# Altium schematic sheet MCU.SchDoc
size A4
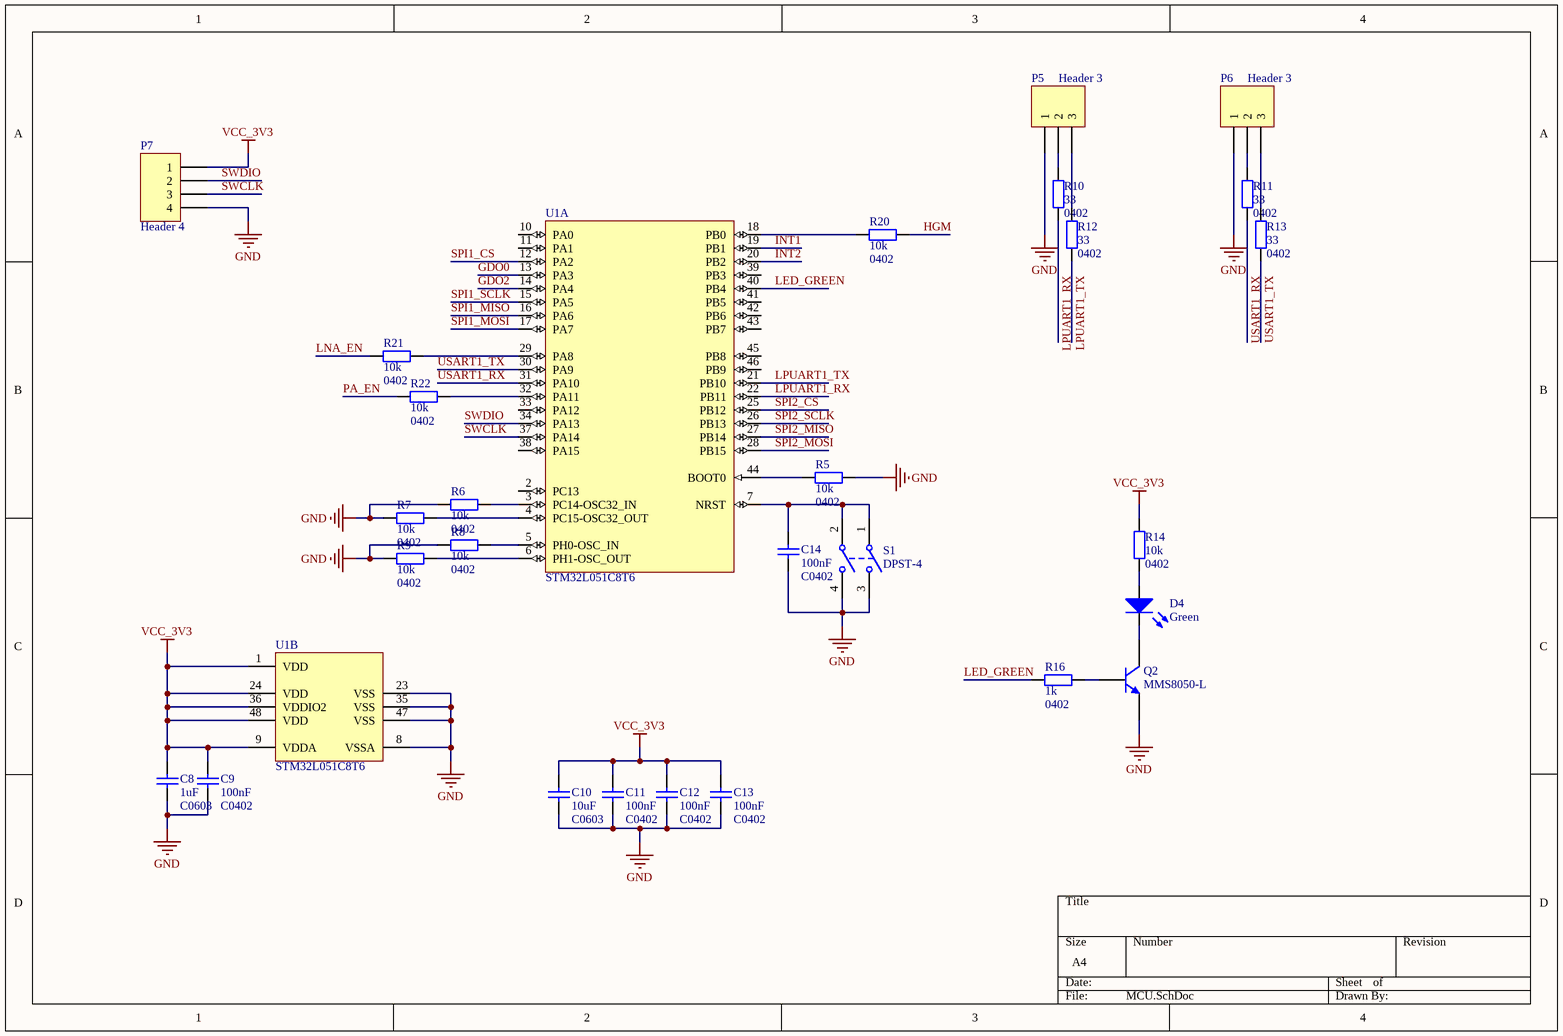
[diagram p0: MCU.SchDoc]

## Parts
C8  1uF  PackageReference: C0603  [1608[0603]]
C9  100nF  PackageReference: C0402  [0402]
C10  10uF  PackageReference: C0603  [1608[0603]]
C11  100nF  PackageReference: C0402  [0402]
C12  100nF  PackageReference: C0402  [0402]
C13  100nF  PackageReference: C0402  [0402]
C14  100nF  PackageReference: C0402  [0402]
D4  Green  [0603/K]
P5  Header 3  [HDR1X3]
P6  Header 3  [HDR1X3]
P7  Header 4  [HDR1x4-2MM]
Q2  MMS8050-L  [SOT-23B_N]
R5  10k  PackageReference: 0402  [RESC1005X04N]
R6  10k  PackageReference: 0402  [RESC1005X04N]
R7  10k  PackageReference: 0402  [RESC1005X04N]
R8  10k  PackageReference: 0402  [RESC1005X04N]
R9  10k  PackageReference: 0402  [RESC1005X04N]
R10  33  PackageReference: 0402  [RESC1005X04N]
R11  33  PackageReference: 0402  [RESC1005X04N]
R12  33  PackageReference: 0402  [RESC1005X04N]
R13  33  PackageReference: 0402  [RESC1005X04N]
R14  10k  PackageReference: 0402  [RESC1005X04N]
R16  1k  PackageReference: 0402  [RESC1005X04N]
R20  10k  PackageReference: 0402  [RESC1005X04N]
R21  10k  PackageReference: 0402  [RESC1005X04N]
R22  10k  PackageReference: 0402  [RESC1005X04N]
S1  DPST-4  [DPST]
U1  STM32L051C8T6  [STM-LQFP48_N]  (parts A,B of 2)

## Nets
GND: C8.1 C9.1 C10.1 C11.2 C12.2 C13.2 C14.2 P5.1 P6.1 P7.4 Q2.E R5.2 R6.1 R7.1 R8.1 R9.1 S1.3(NO1) S1.4(NO2) U1.8(VSSA) U1.23(VSS) U1.35(VSS) U1.47(VSS)
VCC_3V3: C8.2 C9.2 C10.2 C11.1 C12.1 C13.1 P7.1 R14.2 U1.1(VDD) U1.9(VDDA) U1.24(VDD) U1.36(VDDIO2) U1.48(VDD)
GDO0: U1.13(PA3)
GDO2: U1.14(PA4)
HGM: R20.2
INT1: U1.19(PB1)
INT2: U1.20(PB2)
LED_GREEN: R16.1 U1.40(PB4)
LNA_EN: R21.1
LPUART1_RX: R10.1 U1.22(PB11)
LPUART1_TX: R12.2 U1.21(PB10)
PA_EN: R22.1
SPI1_CS: U1.12(PA2)
SPI1_MISO: U1.16(PA6)
SPI1_MOSI: U1.17(PA7)
SPI1_SCLK: U1.15(PA5)
SPI2_CS: U1.25(PB12)
SPI2_MISO: U1.27(PB14)
SPI2_MOSI: U1.28(PB15)
SPI2_SCLK: U1.26(PB13)
SWCLK: P7.3 U1.37(PA14)
SWDIO: P7.2 U1.34(PA13)
USART1_RX: R11.1 U1.31(PA10)
USART1_TX: R13.2 U1.30(PA9)
NetC14_1: C14.1 S1.1(COMMON1) S1.2(COMMON2) U1.7(NRST)
NetD4_A: D4.A R14.1
NetD4_K: D4.K Q2.C
NetP5_2: P5.2 R10.2
NetP5_3: P5.3 R12.1
NetP6_2: P6.2 R11.2
NetP6_3: P6.3 R13.1
NetQ2_B: Q2.B R16.2
NetR5_1: R5.1 U1.44(BOOT0)
NetR6_2: R6.2 U1.3(PC14-OSC32_IN)
NetR7_2: R7.2 U1.4(PC15-OSC32_OUT)
NetR8_2: R8.2 U1.5(PH0-OSC_IN)
NetR9_2: R9.2 U1.6(PH1-OSC_OUT)
NetR20_1: R20.1 U1.18(PB0)
NetR21_2: R21.2 U1.29(PA8)
NetR22_2: R22.2 U1.32(PA11)

Not connected (* = marked no-connect by the designer): U1 2(PC13) 10(PA0) 11(PA1) 33(PA12) 38(PA15) 39(PB3) 41(PB5) 42(PB6) 43(PB7) 45(PB8) 46(PB9)

## Library data of the parts
C8 = CGA3E2X5R1A105K080AA: Capacitor (0603,X5R,1uF,DC 10V,+/-10%) TDK; Published: 8-Jun-2000; LatestRevisionDate: 29-May-2009; LatestRevisionNote: IPC-7351 Footprint Added.; Publisher: Altium Limited; PackageDescription: Chip Capacitor; Value: 1uF
C9 C11-C14 = CGA2B2X5R1A104K050BA: Capacitor (0402,X5R,100nF,DC 10V,±10%) TDK; Published: 8-Jun-2000; LatestRevisionDate: 29-May-2009; LatestRevisionNote: IPC-7351 Footprint Added.; Publisher: Altium Limited; PackageDescription: Chip Capacitor; Value: 100nF
C10 = C1608X5R1A106K080AC: Capacitor (0603,X5R,10uF,DC 10V,±10%) TDK; Published: 8-Jun-2000; LatestRevisionDate: 29-May-2009; LatestRevisionNote: IPC-7351 Footprint Added.; Publisher: Altium Limited; PackageDescription: Chip Capacitor; Value: 10uF
D4 = TLMG1100-GS08: Standard 0603 SMD LED, Green, 2.1V,-40 °C to +100 °C; Published: 8-Jun-2000; LatestRevisionDate: 17-Jul-2002; LatestRevisionNote: Re-released for DXP Platform.; PackageVersion: Feb-2002; PackageReference: 0603; Publisher: Altium Limited; PackageDescription: SM LED; 2 Flat Leads; Valid: Green
P5 P6 = Header 3: Header, 3-Pin; LatestRevisionDate: 17-Jul-2002; LatestRevisionNote: Re-released for DXP Platform.; Publisher: Altium Limited
P7 = Header 4: Header, 4-Pin; LatestRevisionDate: 17-Jul-2002; LatestRevisionNote: Re-released for DXP Platform.; Publisher: Altium Limited
Q2 = MMS8050-L: NPN Silicon  Plastic-Encapsulate  Transistor , MCC , Range:120-200; Published: 8-Jun-2000; LatestRevisionDate: 17-Jul-2002; LatestRevisionNote: Re-released for DXP Platform.; PackageReference: TO-226-AA; Publisher: Altium Limited; PackageDescription: TO, Flat Index; 3 In-Line, Axial Leads; Body Dia. 4.8mm; Leads 0.55 x 0.51 mm (max); Code_JEDEC: TO-226-AA
R5-R9 R14 R20-R22 = RC0402FR-0710KL: Resistor 0402(1005) 10kΩ ±1%; PackageDescription: Chip Resistor, 2-Leads, Body 1.00x0.50mm, IPC Medium Density; Value: 10k
R10-R13 = RC0402FR-0733RL: Resistor 0402(1005) 33Ω ±1%; PackageDescription: Chip Resistor, 2-Leads, Body 1.00x0.50mm, IPC Medium Density; Value: 33
R16 = RC0402FR-071KL: Resistor 0402(1005) 1kΩ ±1%; PackageDescription: Chip Resistor, 2-Leads, Body 1.00x0.50mm, IPC Medium Density; Value: 1k
S1 = CX-G001: 5.2*5.2轻触开关; Published: 24-Mar-1999; LatestRevisionDate: 17-Jul-2002; LatestRevisionNote: Re-released for DXP Platform.; PackageReference: DPST-4; Publisher: Altium Limited; PackageDescription: Switch; 4 Leads
U1 = STM32L051C8T6: Access line ultra-low-power 32-bit MCU Arm®-based Cortex®-M0+, 64 KB Flash, 8 KB SRAM,2 KB EEPROM, 38 fast I/Os, 48-pin LQFP, -40 to 125 degC, Tray; A/D Converter: 2x12-bit; Core: ARM Cortex-M0+; FLASH Size (Prog) (kB): 64; I/Os (High Current): 37; Internal RAM Size (kB): 20; Operating Frequency(F) (Processor speed) (MHz): 32; Supply Voltage(Vcc) min (V): 2; DatasheetVersion: Rev. 16; PackageVersion: Rev. 6, 06/2013; PackageReference: LQFP48; PackageDescription: 48-Pin Low Profile Quad Flat Package, 7 x 7 mm Body, 0.5 mm Pitch; Supplier 1: Digi-Key; Supplier Part Number 1: 497-11517-ND; Supplier 2: Farnell; Supplier Part Number 2: 1899017; Supplier 3: Newark; Supplier Part Number 3: 72T2644; Supplier 4: Mouser; Supplier Part Number 4: 511-STM32L051C8T6; Packing: Tray; Mounting Technology: Surface Mount; PartNumber: STM32L051C8T6; ComponentLink1Description: Manufacturer URL; ComponentLink1URL: http://www.st.com/web/en/home.html; ComponentLink2Description: Datasheet; ComponentLink2URL: http://www.st.com/st-web-ui/static/active/en/resource/technical/document/datasheet/CD00161566.pdf; ComponentLink3Description: Package Specification; ComponentLink3URL: http://www.st.com/st-web-ui/static/active/en/resource/technical/document/datasheet/DM00058181.pdf